# Altium project CRIB.PrjPcb (part 2 of 2)

## Sheet Throttle ADC.SchDoc
size A4; Organization: TESLA Motors, INC; Address1: 3500 Deer Creek Road; Address2: Palo Alto, CA; Address4: U.S.A.; SheetNumber: 10; SheetTotal: 17
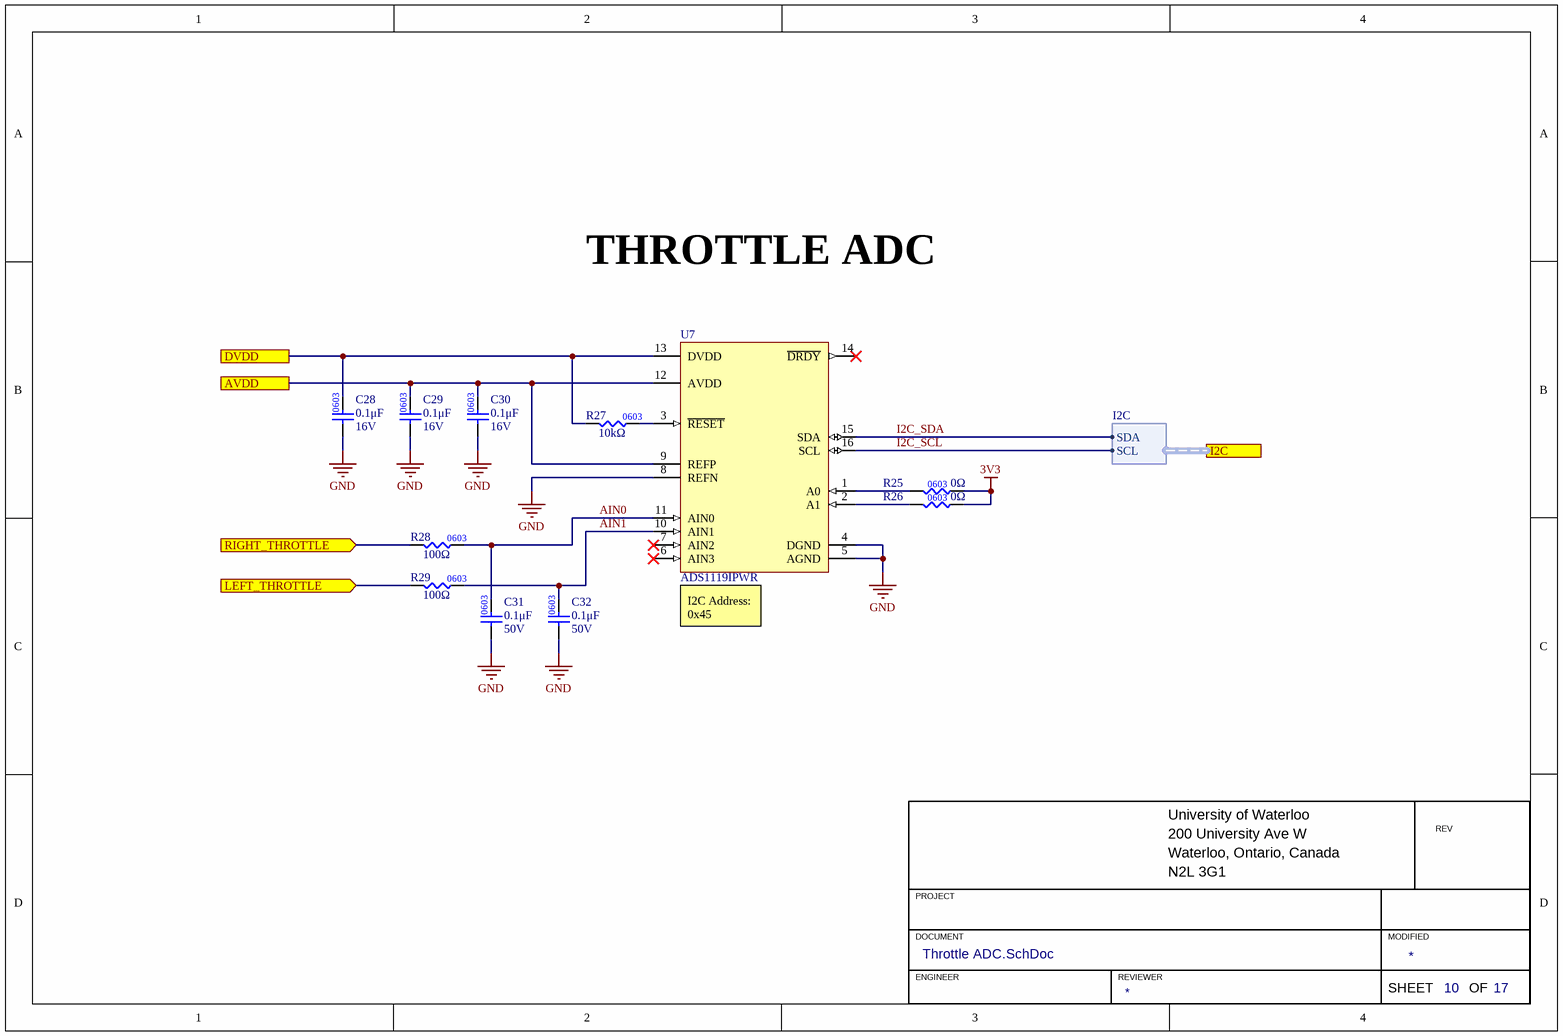
[diagram p10: Throttle ADC.SchDoc]

### Parts
C28  value 0.1μF  Voltage Rating: 16V  [CAP0603]  (hidden comment: CAP_0.1uF_16V_0603)
C29  value 0.1μF  Voltage Rating: 16V  [CAP0603]  (hidden comment: CAP_0.1uF_16V_0603)
C30  value 0.1μF  Voltage Rating: 16V  [CAP0603]  (hidden comment: CAP_0.1uF_16V_0603)
C31  value 0.1μF  Voltage Rating: 50V  [CAP0603]  (hidden comment: CAP_0.1uF_50V_0603)
C32  value 0.1μF  Voltage Rating: 50V  [CAP0603]  (hidden comment: CAP_0.1uF_50V_0603)
R25  value 0Ω  [RES0603]  (hidden comment: RES_0Ω_0603)
R26  value 0Ω  [RES0603]  (hidden comment: RES_0Ω_0603)
R27  value 10kΩ  [RES0603]  (hidden comment: RES_10kΩ_0603_1%)
R28  value 100Ω  [RES0603]  (hidden comment: RES_100Ω_0603_1%)
R29  value 100Ω  [RES0603]  (hidden comment: RES_100Ω_0603_1%)
U7  ADS1119IPWR  [TI_16-TSSOP]

### Ports
AVDD (see Top[3A]), DVDD (see Top[3A]), I2C (harness I2C, see Top[3A], Real Time Clock[4B], STM32 MCU[1A]), LEFT_THROTTLE (in, see Top[4A], Throttle Interfaces[2C]), RIGHT_THROTTLE (in, see Top[4A], Throttle Interfaces[2B])

### Harnesses
I2C: SDA, SCL

### Nets
3V3: C28.2 R25.1 R26.1 R27.1 U7.13(DVDD) ; port DVDD
5V0L: C29.2 C30.2 U7.9(REFP) U7.12(AVDD) ; port AVDD
GND: C28.1 C29.1 C30.1 C31.1 C32.1 U7.4(DGND) U7.5(AGND) U7.8(REFN)
AIN0: C31.2 R28.2 U7.11(AIN0)
AIN1: C32.2 R29.2 U7.10(AIN1)
I2C_SCL: U7.16(SCL) ; port I2C.SCL  [project net I2C.SCL]
I2C_SDA: U7.15(SDA) ; port I2C.SDA  [project net I2C.SDA]
LEFT_THROTTLE: R29.1 ; port LEFT_THROTTLE
RIGHT_THROTTLE: R28.1 ; port RIGHT_THROTTLE
NetR25_2: R25.2 U7.1(A0)
NetR26_2: R26.2 U7.2(A1)
NetR27_2: R27.2 U7.3(~{RESET})

Not connected (* = marked no-connect by the designer): U7 6(AIN3)* 7(AIN2)* 14(~{DRDY})*

### Notes on the sheet
- THROTTLE ADC
- (near U7) I2C Address:
  0x45
- University of Waterloo
- 200 University Ave W
- REV
- PROJECT
- Waterloo, Ontario, Canada
- N2L 3G1
- DOCUMENT
- ENGINEER
- REVIEWER
- MODIFIED
- SHEET
- OF
- (in symbol RES_100Ω_0603_1%) 0603

### Library data of the parts
C28-C30 = CAP_0.1uF_16V_0603: CAP CER 0.1UF 16V X7R 0603; Manufacturer Part Number 1: CC0603KRX7R7BB104; Manufacturer 1: Yageo; Package: 0603; Supplier Part Number 1: 311-1088-1-ND; Supplier 1: Digi-Key; Dielectric: X7R
C31 C32 = CAP_0.1uF_50V_0603: as C8 on sheet System Voltage Regulators; Supplier Part Number 1: 311-1344-1-ND; Supplier 1: Digi-Key; Mounting Type: SMD; Dielectric: X7R
R25 R26 = RES_0Ω_0603: RES 0 OHM JUMPER 1/10W 0603; Manufacturer 1: Yageo; Manufacturer Part Number 1: RC0603JR-070RL; Supplier Part Number 1: 311-0.0GRCT-ND; Supplier 1: Digi-Key; Mounting Type: SMD; Package: 0603
R27 = RES_10kΩ_0603_1%: as R33 on sheet STM32 MCU; Supplier Part Number 1: RNCP0603FTD10K0CT-ND; Supplier 1: Digi-Key; Mounting Type: SMD; Package: 0603
R28 R29 = RES_100Ω_0603_1%: RES 100 OHM 1% 1/10W 0603; Manufacturer 1: Yageo; Manufacturer Part Number 1: RC0603FR-07100RL; Supplier Part Number 1: 311-100HRCT-ND; Supplier 1: Digi-Key
U7 = ADS1119IPWR: IC ADC 16BIT SIGMA-DELTA 16TSSOP; Manufacturer 1: Texas Instruments; Manufacturer Part Number 1: ADS1119IPWR; Footprint: 16-TSSOP; Supplier 1: Digikey; Supplier Part Number 1: 296-50874-1-ND

## Sheet Throttle Interfaces.SchDoc
size A4; Organization: TESLA Motors, INC; Address1: 3500 Deer Creek Road; Address2: Palo Alto, CA; Address4: U.S.A.; SheetNumber: 12; SheetTotal: 21
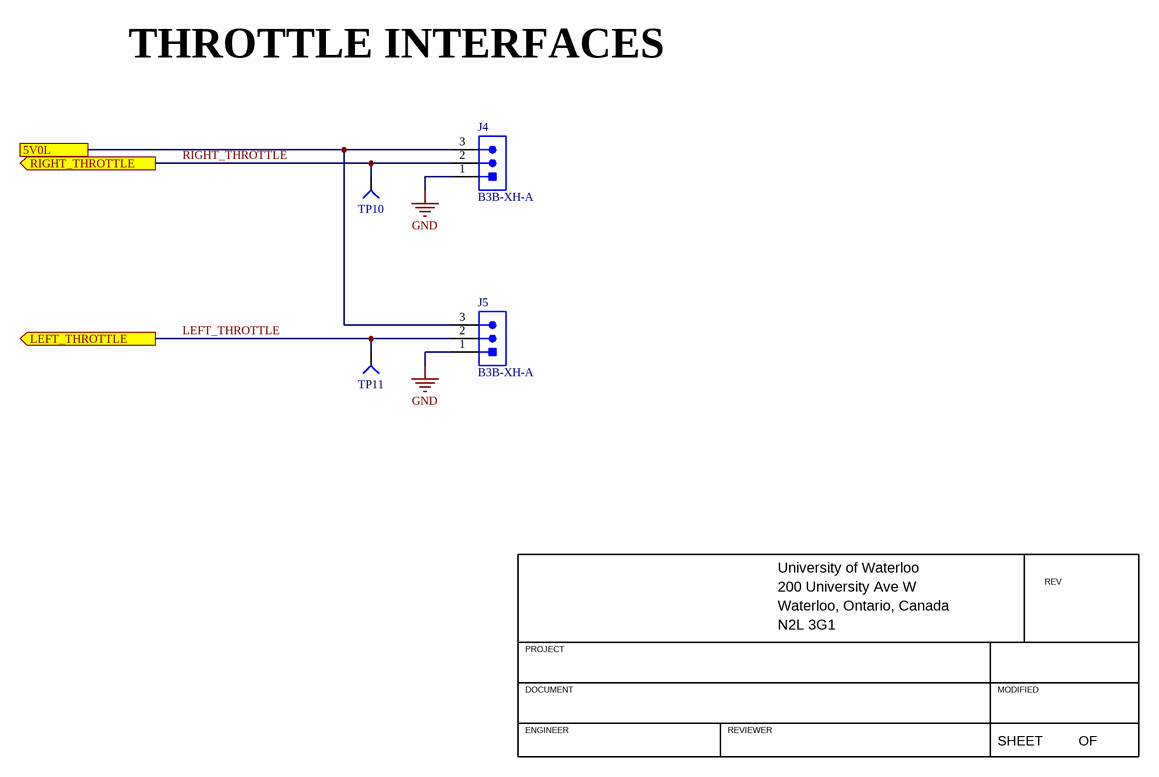
[diagram p11: Throttle Interfaces.SchDoc]

### Parts
J4  Manufacturer Part Number 1: B3B-XH-A  [JST_XH_3POS]  (hidden comment: CON_JST_3POS)
J5  Manufacturer Part Number 1: B3B-XH-A  [JST_XH_3POS]  (hidden comment: CON_JST_3POS)
TP10  TESTPOINT_1MM_CIRCLE  [TESTPOINT_CIRCLE_1MM]  (value not drawn)  (no BOM)
TP11  TESTPOINT_1MM_CIRCLE  [TESTPOINT_CIRCLE_1MM]  (value not drawn)  (no BOM)

### Ports
5V0L, LEFT_THROTTLE (out), RIGHT_THROTTLE (out)

### Nets
5V0L: J4.3 J5.3 ; port 5V0L
GND: J4.1 J5.1
LEFT_THROTTLE: J5.2 TP11.1(=value) ; port LEFT_THROTTLE
RIGHT_THROTTLE: J4.2 TP10.1(=value) ; port RIGHT_THROTTLE

### Notes on the sheet
- THROTTLE INTERFACES
- University of Waterloo
- 200 University Ave W
- REV
- PROJECT
- Waterloo, Ontario, Canada
- N2L 3G1
- DOCUMENT
- ENGINEER
- REVIEWER
- MODIFIED
- SHEET
- OF

### Library data of the parts
J4 J5 = CON_JST_3POS: CONN HEADER VERT 3POS 2.5MM; Manufacturer 1: JST Sales America Inc.; Voltage Rating: 250VAC; Current Rating: 3A; Pitch: 2.5mm; Supplier 1: Digi-Key; Supplier Part Number 1: 455-2248-ND
TP10 TP11 = TESTPOINT_1MM_CIRCLE: TESTPOINT 1MM CIRCLE

## Sheet Real Time Clock.SchDoc
size A4; Organization: TESLA Motors, INC; Address1: 3500 Deer Creek Road; Address2: Palo Alto, CA; Address4: U.S.A.; SheetNumber: 13; SheetTotal: 21
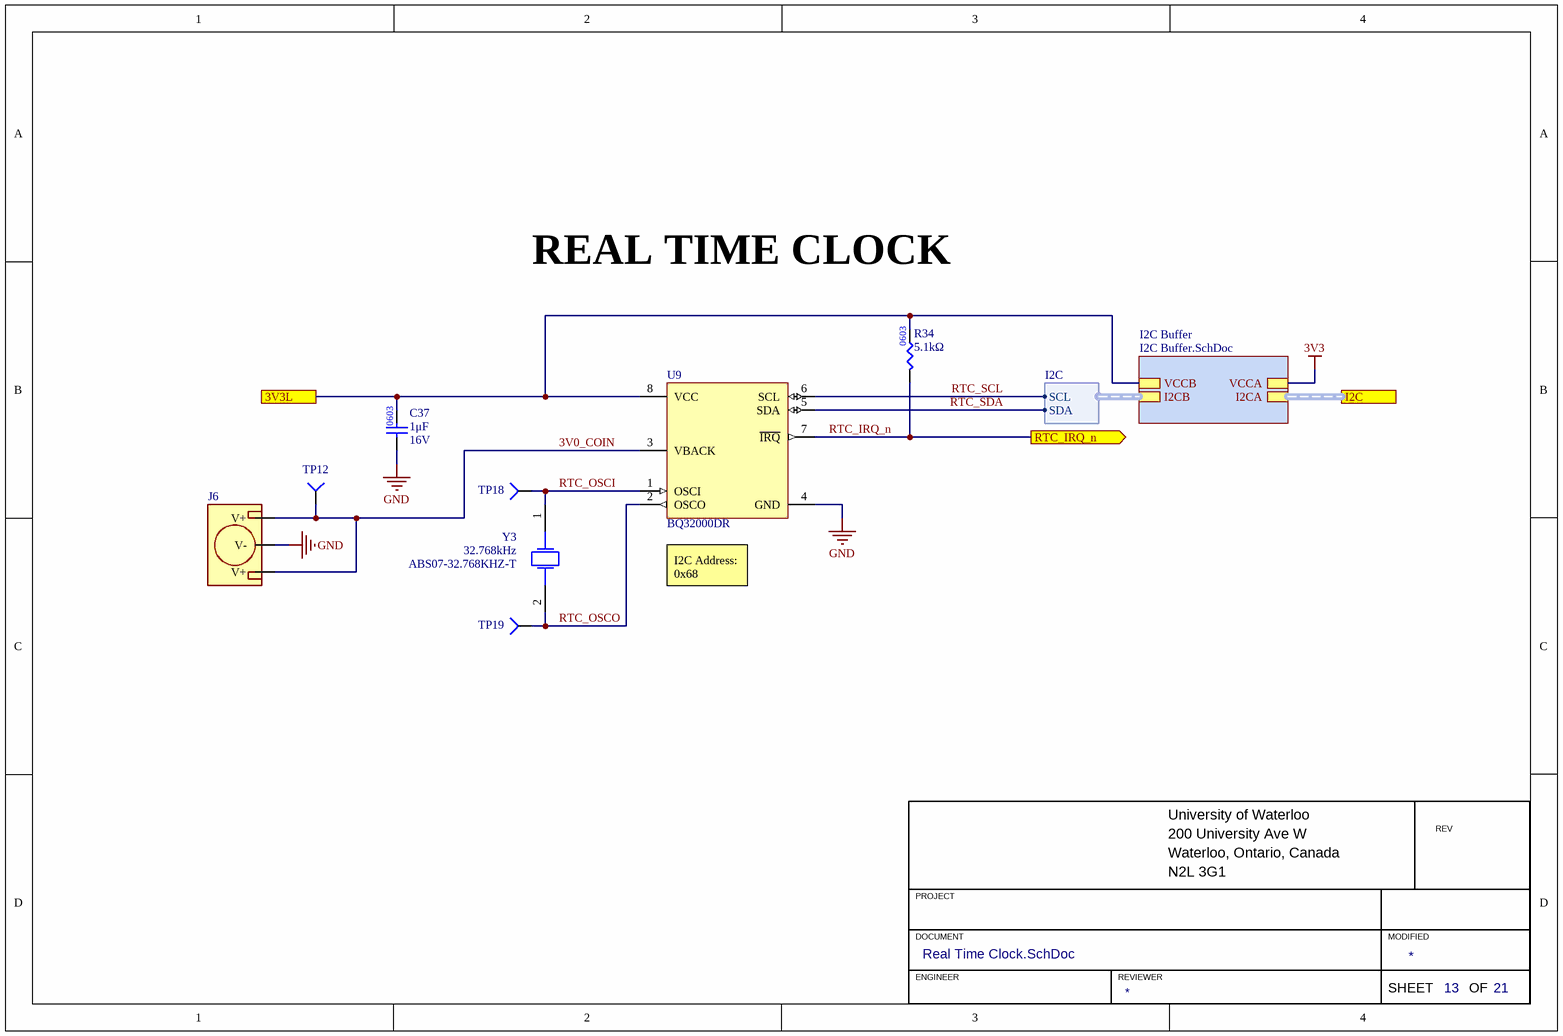
[diagram p12: Real Time Clock.SchDoc]

### Parts
C37  value 1μF  Voltage Rating: 16V  [CAP0603]  (hidden comment: CAP_1uF_16V_0603)
J6  CON_2POS_CR1220  [ATECH_COIN_12MM]  (value not drawn)
R34  value 5.1kΩ  [RES0603]  (hidden comment: RES_5.1kΩ_0603_1%)
TP12  TESTPOINT_1MM_CIRCLE  [TESTPOINT_CIRCLE_1MM]  (value not drawn)  (no BOM)
TP18  TESTPOINT_1MM_CIRCLE  [TESTPOINT_CIRCLE_1MM]  (value not drawn)  (no BOM)
TP19  TESTPOINT_1MM_CIRCLE  [TESTPOINT_CIRCLE_1MM]  (value not drawn)  (no BOM)
U9  BQ32000DR  [TI_8-SOIC]
Y3  Frequency: 32.768kHz  Manufacturer Part Number 1: ABS07-32.768KHZ-T  [OSC_ABS07]  (hidden comment: CRYSTAL_32.768KHZ_ABRACON)

### Sub-sheets
I2C Buffer = I2C Buffer.SchDoc: I2CA (harness I2C), I2CB (harness I2C), VCCA, VCCB

### Ports
3V3L, I2C (harness I2C), RTC_IRQ_n (out)

### Harnesses
I2C: SDA, SCL

### Nets
3V3L: C37.2 R34.2 U9.8(VCC) ; port 3V3L, sheet I2C Buffer/VCCB
GND: C37.1 J6.2(V-) U9.4(GND)
3V0_COIN: J6.1(V+) TP12.1(=value) U9.3(VBACK)
RTC_IRQ_n: R34.1 U9.7(~{IRQ}) ; port RTC_IRQ_n
RTC_OSCI: TP18.1(=value) U9.1(OSCI) Y3.1
RTC_OSCO: TP19.1(=value) U9.2(OSCO) Y3.2
RTC_SCL: U9.6(SCL) ; sheet I2C Buffer/I2CB.SCL
RTC_SDA: U9.5(SDA) ; sheet I2C Buffer/I2CB.SDA

### Buses and harness runs
harness port I2C = sheet I2C Buffer/I2CA

### Notes on the sheet
- REAL TIME CLOCK
- (near U9) I2C Address:
  0x68
- University of Waterloo
- 200 University Ave W
- REV
- PROJECT
- Waterloo, Ontario, Canada
- N2L 3G1
- DOCUMENT
- ENGINEER
- REVIEWER
- MODIFIED
- SHEET
- OF

### Library data of the parts
C37 = CAP_1uF_16V_0603: CAP CER 1UF 16V X7R 0603; Manufacturer 1: Yageo; Manufacturer Part Number 1: CC0603KPX7R7BB105; Supplier Part Number 1: 13-CC0603KPX7R7BB105CT-ND; Supplier 1: Digi-Key; Mounting Type: SMD; Package: 0603; Dielectric: X7R
J6 = CON_2POS_CR1220: BATTERY RETAINER COIN 12MM SMD; Manufacturer 1: Adam Tech; Manufacturer Part Number 1: BH-122A-5; Mounting Type: SMD; Supplier 1: Digi-Key; Supplier Part Number 1: 2057-BH-122A-5-ND
R34 = RES_5.1kΩ_0603_1%: RES 5.1K OHM 1% 1/10W 0603; Manufacturer 1: YAGEO; Manufacturer Part Number 1: RC0603FR-135K1L; Mounting Type: SMD; Package: 0603; Supplier 1: Digi-Key; Supplier Part Number 1: 13-RC0603FR-135K1LCT-ND
TP12 TP18 TP19 = TESTPOINT_1MM_CIRCLE: TESTPOINT 1MM CIRCLE
U9 = BQ32000DR: IC RTC CLK/CALENDAR I2C 8SOIC; Manufacturer 1: Texas Instruments; Package/Footprint: 8-SOIC; Supplier 1: Digi-Key; Supplier Part Number 1: 296-24583-1-ND; Manufacturer Part Number 1: BQ32000DR
Y3 = CRYSTAL_32.768KHZ_ABRACON: CRYSTAL 32.7680KHZ 12.5PF SMD; Manufacturer 1: Abracon LLC; Supplier 1: Digi-Key; Supplier Part Number 1: 535-9542-1-ND

## Sheet I2C Buffer.SchDoc
size A4; Organization: TESLA Motors, INC; Address1: 3500 Deer Creek Road; Address2: Palo Alto, CA; Address4: U.S.A.; SheetNumber: 13; SheetTotal: 17
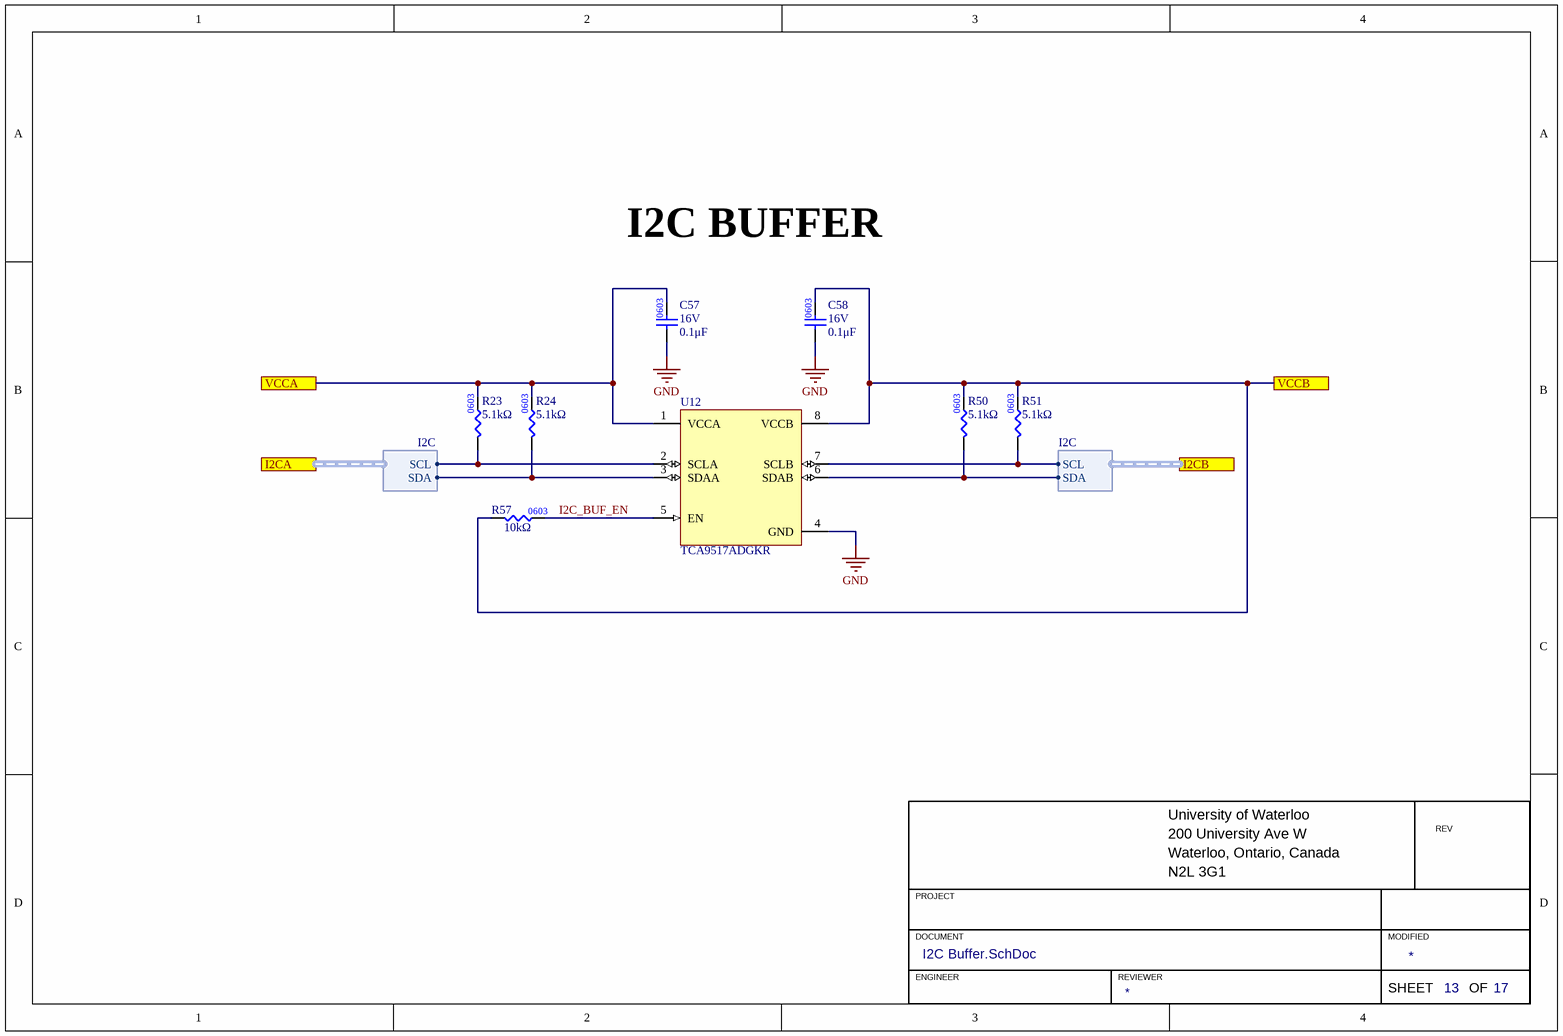
[diagram p13: I2C Buffer.SchDoc]

### Parts
C57  value 0.1μF  Voltage Rating: 16V  [CAP0603]  (hidden comment: CAP_0.1uF_16V_0603)
C58  value 0.1μF  Voltage Rating: 16V  [CAP0603]  (hidden comment: CAP_0.1uF_16V_0603)
R23  value 5.1kΩ  [RES0603]  (hidden comment: RES_5.1kΩ_0603_1%)
R24  value 5.1kΩ  [RES0603]  (hidden comment: RES_5.1kΩ_0603_1%)
R50  value 5.1kΩ  [RES0603]  (hidden comment: RES_5.1kΩ_0603_1%)
R51  value 5.1kΩ  [RES0603]  (hidden comment: RES_5.1kΩ_0603_1%)
R57  value 10kΩ  [RES0603]  (hidden comment: RES_10kΩ_0603_1%)
U12  TCA9517ADGKR  [TI_8-VSSOP]

### Ports
I2CA (harness I2C, see Real Time Clock[4B]), I2CB (harness I2C, see Real Time Clock[3B]), VCCA (see Real Time Clock[4B]), VCCB (see Real Time Clock[3B])

### Harnesses
I2C: SDA, SCL

### Nets
3V3: C57.2 R23.2 R24.2 U12.1(VCCA) ; port VCCA
3V3L: C58.2 R50.2 R51.2 R57.1 U12.8(VCCB) ; port VCCB
GND: C57.1 C58.1 U12.4(GND)
I2C.SCL: R23.1 U12.2(SCLA) ; port I2CA.SCL
I2C.SDA: R24.1 U12.3(SDAA) ; port I2CA.SDA
I2C_BUF_EN: R57.2 U12.5(EN)
RTC_SCL: R51.1 U12.7(SCLB) ; port I2CB.SCL
RTC_SDA: R50.1 U12.6(SDAB) ; port I2CB.SDA

### Notes on the sheet
- I2C BUFFER
- University of Waterloo
- 200 University Ave W
- REV
- PROJECT
- Waterloo, Ontario, Canada
- N2L 3G1
- DOCUMENT
- ENGINEER
- REVIEWER
- MODIFIED
- SHEET
- OF

### Library data of the parts
C57 C58 = CAP_0.1uF_16V_0603: as C28 on sheet Throttle ADC; Package: 0603; Supplier Part Number 1: 311-1088-1-ND; Supplier 1: Digi-Key; Dielectric: X7R
R23 R24 R50 R51 = RES_5.1kΩ_0603_1%: as R34 on sheet Real Time Clock; Mounting Type: SMD; Package: 0603; Supplier 1: Digi-Key; Supplier Part Number 1: 13-RC0603FR-135K1LCT-ND
R57 = RES_10kΩ_0603_1%: as R33 on sheet STM32 MCU; Supplier Part Number 1: RNCP0603FTD10K0CT-ND; Supplier 1: Digi-Key; Mounting Type: SMD; Package: 0603
U12 = TCA9517ADGKR: IC XLTR VL BIDIR 8-VSSOP; Manufacturer 1: Texas Instruments; Package/Footprint: 8-TSSOP; Manufacturer Part Number 1: TCA9517ADGKR; Supplier 1: Digikey; Supplier Part Number 1: 296-39220-1-ND

## Sheet SD Card Interface.SchDoc
size A4; Organization: TESLA Motors, INC; Address1: 3500 Deer Creek Road; Address2: Palo Alto, CA; Address4: U.S.A.; SheetNumber: 15; SheetTotal: 21
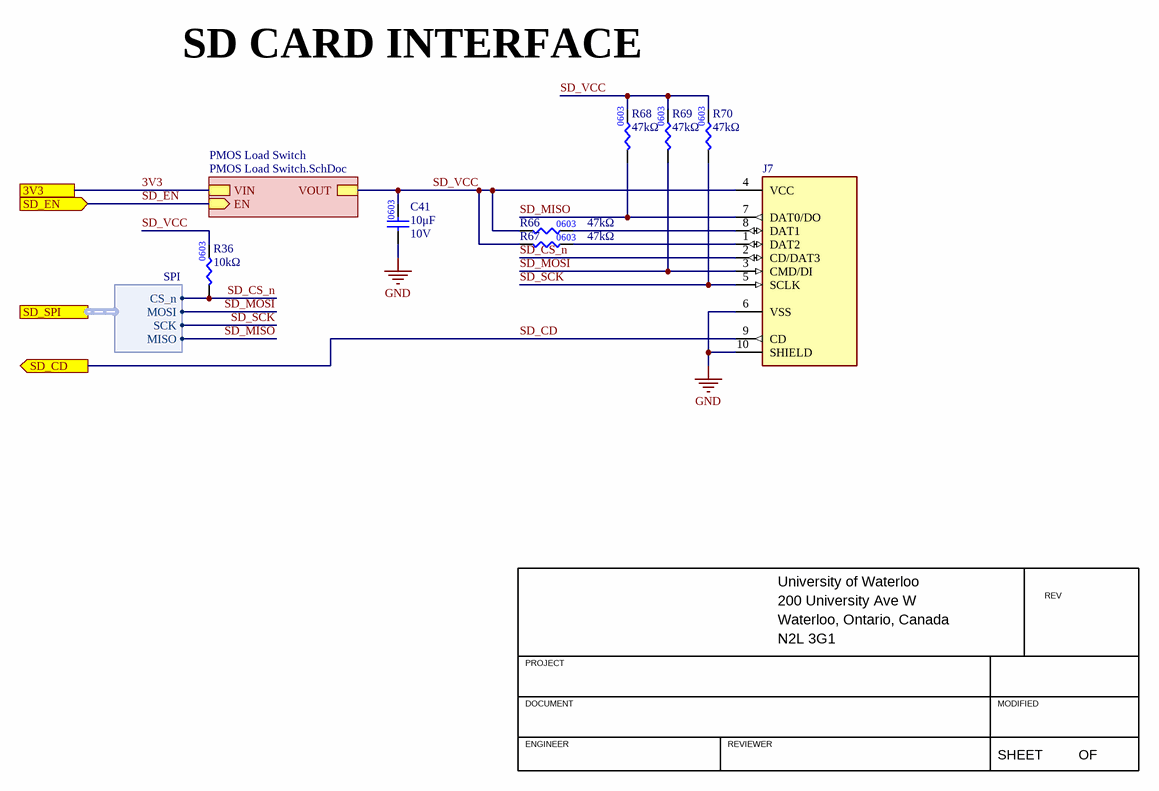
[diagram p14: SD Card Interface.SchDoc]

### Parts
C41  value 10μF  Voltage Rating: 10V  [CAP0603]  (hidden comment: CAP_10uF_10V_0603)
J7  CON_MICROSD_MOLEX  [MOLEX-5033981892]  (value not drawn)
R36  value 10kΩ  [RES0603]  (hidden comment: RES_10kΩ_0603_1%)
R66  value 47kΩ  [RES0603]  (hidden comment: RES_47kΩ_0603_1%)
R67  value 47kΩ  [RES0603]  (hidden comment: RES_47kΩ_0603_1%)
R68  value 47kΩ  [RES0603]  (hidden comment: RES_47kΩ_0603_1%)
R69  value 47kΩ  [RES0603]  (hidden comment: RES_47kΩ_0603_1%)
R70  value 47kΩ  [RES0603]  (hidden comment: RES_47kΩ_0603_1%)

### Sub-sheets
PMOS Load Switch = PMOS Load Switch.SchDoc: VIN, VOUT, EN (in)

### Ports
3V3, SD_CD (out), SD_EN (in), SD_SPI (harness SPI)

### Harnesses
SPI: CS_n, MOSI, MISO, SCK

### Nets
3V3: port 3V3, sheet PMOS Load Switch/VIN
GND: C41.1 J7.6(VSS) J7.10(SHIELD)
SD_CD: J7.9(CD) ; port SD_CD
SD_CS_n: J7.2(CD/DAT3) R36.1 ; port SD_SPI.CS_n
SD_EN: port SD_EN, sheet PMOS Load Switch/EN
SD_MISO: J7.7(DAT0/DO) R68.1 ; port SD_SPI.MISO
SD_MOSI: J7.3(CMD/DI) R69.1 ; port SD_SPI.MOSI
SD_SCK: J7.5(SCLK) R70.1 ; port SD_SPI.SCK
SD_VCC: C41.2 J7.4(VCC) R36.2 R66.1 R67.1 R68.2 R69.2 R70.2 ; sheet PMOS Load Switch/VOUT
NetJ7_1: J7.1(DAT2) R67.2
NetJ7_8: J7.8(DAT1) R66.2

### Notes on the sheet
- SD CARD INTERFACE
- University of Waterloo
- 200 University Ave W
- REV
- PROJECT
- Waterloo, Ontario, Canada
- N2L 3G1
- DOCUMENT
- ENGINEER
- REVIEWER
- MODIFIED
- SHEET
- OF
- (in symbol CAP_10uF_10V_0603) 0603

### Library data of the parts
C41 = CAP_10uF_10V_0603: CAP CER 10UF 10V X5R 0603; Manufacturer Part Number 1: CC0603MRX5R6BB106; Manufacturer 1: Yageo; Supplier Part Number 1: 311-1817-1-ND; Supplier 1: Digi-Key; Dielectric: X5R
J7 = CON_MICROSD_MOLEX: CONN MICRO SD CARD R/A SMD; Manufacturer 1: Molex; Manufacturer Part Number 1: 5033981892; Supplier 1: Digi-Key; Package/Footprint: SMD; Supplier Part Number 1: WM11190CT-ND
R36 = RES_10kΩ_0603_1%: as R33 on sheet STM32 MCU; Supplier Part Number 1: RNCP0603FTD10K0CT-ND; Supplier 1: Digi-Key; Mounting Type: SMD; Package: 0603
R66-R70 = RES_47kΩ_0603_1%: RES 47K OHM 1% 1/10W 0603; Manufacturer 1: YAGEO; Manufacturer Part Number 1: RC0603FR-0747KL; Mounting Type: SMD; Package: 0603; Supplier 1: DigiKey; Supplier Part Number 1: 311-4.70KHRCT-ND

## Sheet PMOS Load Switch.SchDoc
size A4; Organization: TESLA Motors, INC; Address1: 3500 Deer Creek Road; Address2: Palo Alto, CA; Address4: U.S.A.; SheetNumber: 16; SheetTotal: 21
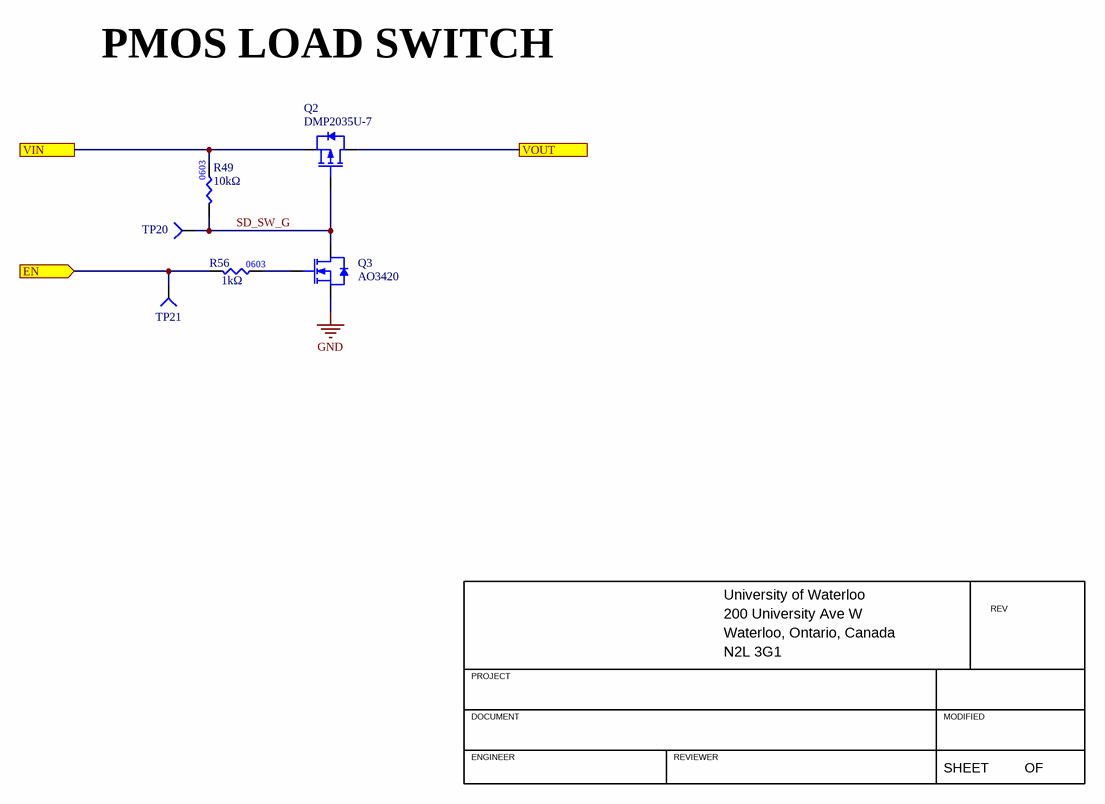
[diagram p15: PMOS Load Switch.SchDoc]

### Parts
Q2  Manufacturer Part Number 1: DMP2035U-7  [DIO-INC_SOT23]  (hidden comment: PMOS_20V_3.6A)
Q3  Manufacturer Part Number 1: AO3420  [SOT23-3]  (hidden comment: NMOS_20V_6A)
R49  value 10kΩ  [RES0603]  (hidden comment: RES_10kΩ_0603_1%)
R56  value 1kΩ  [RES0603]  (hidden comment: RES_1kΩ_0603_1%)
TP20  TESTPOINT_1MM_CIRCLE  [TESTPOINT_CIRCLE_1MM]  (value not drawn)  (no BOM)
TP21  TESTPOINT_1MM_CIRCLE  [TESTPOINT_CIRCLE_1MM]  (value not drawn)  (no BOM)

### Ports
EN (in, see SD Card Interface[2B]), VIN (see SD Card Interface[2B]), VOUT (see SD Card Interface[3B])

### Nets
3V3: Q2.2(Source) R49.2 ; port VIN
GND: Q3.2(SOURCE)
SD_EN: R56.1 TP21.1(=value) ; port EN
SD_SW_G: Q2.1(Gate) Q3.3(DRAIN) R49.1 TP20.1(=value)
SD_VCC: Q2.3(Drain) ; port VOUT
NetQ3_1: Q3.1(GATE) R56.2

### Notes on the sheet
- PMOS LOAD SWITCH
- University of Waterloo
- 200 University Ave W
- REV
- PROJECT
- Waterloo, Ontario, Canada
- N2L 3G1
- DOCUMENT
- ENGINEER
- REVIEWER
- MODIFIED
- SHEET
- OF

### Library data of the parts
Q2 = PMOS_20V_3.6A: MOSFET P-CH 20V 3.6A SOT23-3; Manufacturer 1: Diodes Incorporated; Supplier 1: Digi-Key; Supplier Part Number 1: DMP2035U-7DICT-ND
Q3 = NMOS_20V_6A: MOSFET N-CH 20V 6A SOT-23; Manufacturer 1: Alpha & Omega; Supplier 1: Digi-Key; Supplier Part Number 1: 785-1014-2-ND
R49 = RES_10kΩ_0603_1%: RES 10K OHM 1% 1/8W 0603; Manufacturer 1: Stackpole Electronics Inc; Manufacturer Part Number 1: RNCP0603FTD10K0; Supplier Part Number 1: RNCP0603FTD10K0CT-ND; Supplier 1: Digi-Key; Mounting Type: SMD; Package: 0603
R56 = RES_1kΩ_0603_1%: RES 1K OHM 1% 1/8W 0603; Manufacturer 1: Stackpole Electronics Inc; Manufacturer Part Number 1: RNCP0603FTD1K00; Supplier Part Number 1: RNCP0603FTD1K00CT-ND; Supplier 1: Digi-Key; Mounting Type: SMD; Package: 0603
TP20 TP21 = TESTPOINT_1MM_CIRCLE: TESTPOINT 1MM CIRCLE

## Sheet LED Lamp Interfaces.SchDoc
size A4; Organization: TESLA Motors, INC; Address1: 3500 Deer Creek Road; Address2: Palo Alto, CA; Address4: U.S.A.; SheetNumber: 17; SheetTotal: 21
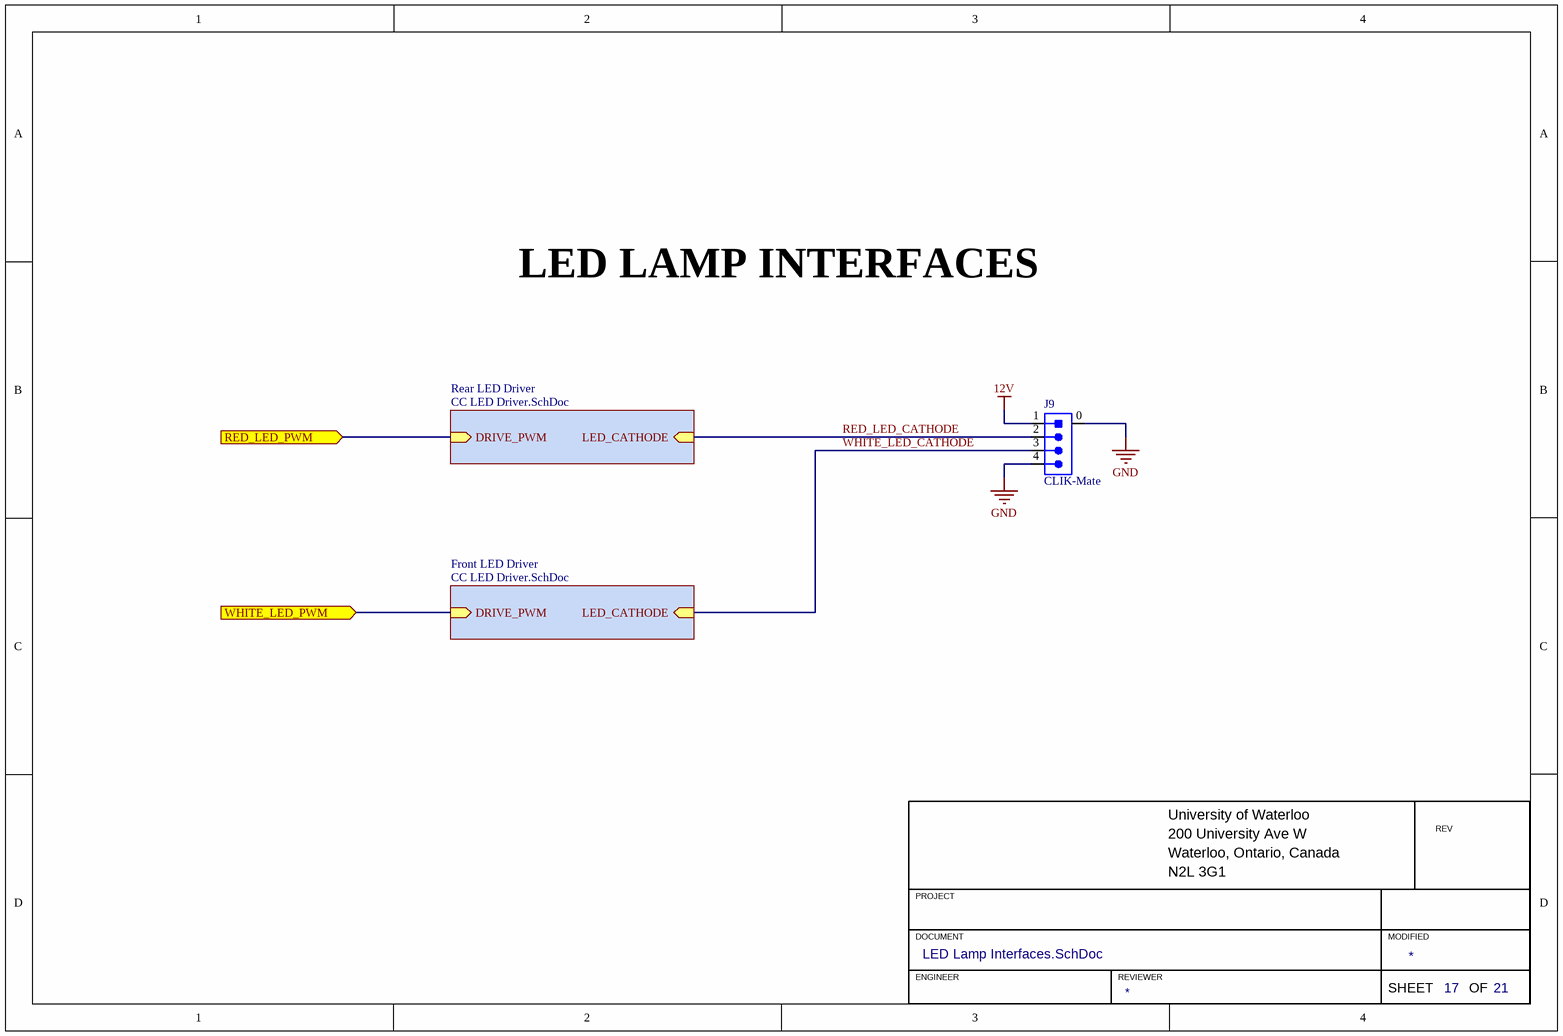
[diagram p16: LED Lamp Interfaces.SchDoc]

### Parts
J9  Family: CLIK-Mate  [MOLEX-5025850470]  (hidden comment: CON_4M_SM_RA)

### Sub-sheets
Front LED Driver = CC LED Driver.SchDoc: LED_CATHODE (in), DRIVE_PWM (in)
Rear LED Driver = CC LED Driver.SchDoc: LED_CATHODE (in), DRIVE_PWM (in)

### Ports
RED_LED_PWM (in), WHITE_LED_PWM (in)

### Nets
12V: J9.1
GND: J9.0 J9.4
RED_LED_CATHODE: J9.2 ; sheet Rear LED Driver/LED_CATHODE
RED_LED_PWM: port RED_LED_PWM, sheet Rear LED Driver/DRIVE_PWM
WHITE_LED_CATHODE: J9.3 ; sheet Front LED Driver/LED_CATHODE
WHITE_LED_PWM: port WHITE_LED_PWM, sheet Front LED Driver/DRIVE_PWM

### Notes on the sheet
- LED LAMP INTERFACES
- University of Waterloo
- 200 University Ave W
- REV
- PROJECT
- Waterloo, Ontario, Canada
- N2L 3G1
- DOCUMENT
- ENGINEER
- REVIEWER
- MODIFIED
- SHEET
- OF

### Library data of the parts
J9 = CON_4M_SM_RA: CONN HEADER SMD RIGHT ANGLE 1.5 MM PITCH; Supplier 1: Digi-Key; Supplier Part Number 1: WM9449CT-ND; Package/Footprint: SMD; Mounting Type: SMD

## Sheet CC LED Driver.SchDoc
size A4; Organization: TESLA Motors, INC; Address1: 3500 Deer Creek Road; Address2: Palo Alto, CA; Address4: U.S.A.; SheetNumber: 18; SheetTotal: 21
Used 2 times, as channels LED Lamp Interfaces/Rear LED Driver, LED Lamp Interfaces/Front LED Driver. Parts and nets are listed once, with the designators drawn on the sheet.
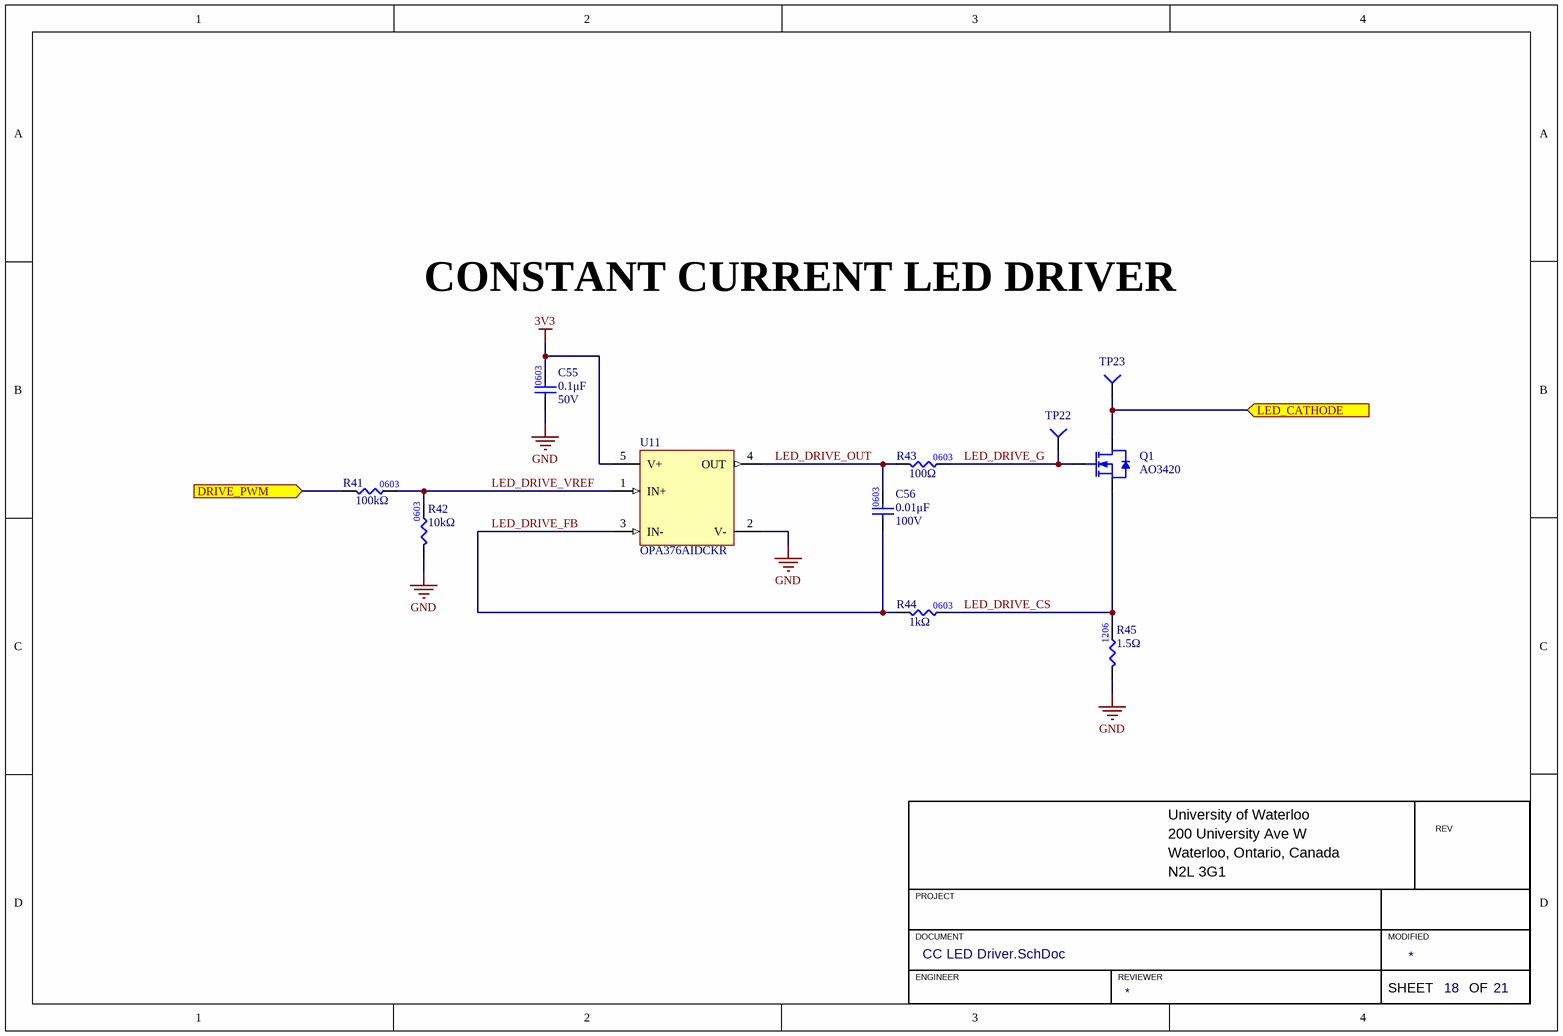
[diagram p17: CC LED Driver.SchDoc]

### Parts
C55  value 0.1μF  Voltage Rating: 50V  [CAP0603]  (hidden comment: CAP_0.1uF_50V_0603)
C56  value 0.01μF  Voltage Rating: 100V  [CAP0603]  (hidden comment: CAP_0.01uF_100V_0603)
Q1  Manufacturer Part Number 1: AO3420  [SOT23-3]  (hidden comment: NMOS_20V_6A)
R41  value 100kΩ  [RES0603]  (hidden comment: RES_100kΩ_0603_1%)
R42  value 10kΩ  [RES0603]  (hidden comment: RES_10kΩ_0603_1%)
R43  value 100Ω  [RES0603]  (hidden comment: RES_100Ω_0603_1%)
R44  value 1kΩ  [RES0603]  (hidden comment: RES_1kΩ_0603_1%)
R45  value 1.5Ω  [RES1206]  (hidden comment: RES_1.5Ω_1206_1%)
TP22  TESTPOINT_1MM_CIRCLE  [TESTPOINT_CIRCLE_1MM]  (value not drawn)  (no BOM)
TP23  TESTPOINT_1MM_CIRCLE  [TESTPOINT_CIRCLE_1MM]  (value not drawn)  (no BOM)
U11  OPA376AIDCKR  [TI_SC-70-5]

### Ports
DRIVE_PWM (in), LED_CATHODE (in)

### Nets
3V3: C55.2 U11.5(V+)
GND: C55.1 R42.1 R45.1 U11.2(V-)
DRIVE_PWM: R41.1 ; port DRIVE_PWM
LED_CATHODE: Q1.3(DRAIN) TP23.1(=value) ; port LED_CATHODE
LED_DRIVE_CS: Q1.2(SOURCE) R44.2 R45.2
LED_DRIVE_FB: C56.1 R44.1 U11.3(IN-)
LED_DRIVE_G: Q1.1(GATE) R43.2 TP22.1(=value)
LED_DRIVE_OUT: C56.2 R43.1 U11.4(OUT)
LED_DRIVE_VREF: R41.2 R42.2 U11.1(IN+)

### Channels
LED Lamp Interfaces/Rear LED Driver: designators end in A; ports DRIVE_PWM=RED_LED_PWM LED_CATHODE=RED_LED_CATHODE
LED Lamp Interfaces/Front LED Driver: designators end in B; ports DRIVE_PWM=WHITE_LED_PWM LED_CATHODE=WHITE_LED_CATHODE

### Notes on the sheet
- CONSTANT CURRENT LED DRIVER
- University of Waterloo
- 200 University Ave W
- REV
- PROJECT
- Waterloo, Ontario, Canada
- N2L 3G1
- DOCUMENT
- ENGINEER
- REVIEWER
- MODIFIED
- SHEET
- OF
- (in symbol CAP_0.01uF_100V_0603) 0603
- (in symbol RES_100kΩ_0603_1%) 0603
- (in symbol RES_100Ω_0603_1%) 0603

### Library data of the parts
C55 = CAP_0.1uF_50V_0603: CAP CER 0.1UF 50V X7R 0603; Manufacturer Part Number 1: CC0603KRX7R9BB104; Manufacturer 1: Yageo; Package/Footprint: 0603; Supplier Part Number 1: 311-1344-1-ND; Supplier 1: Digi-Key; Mounting Type: SMD; Dielectric: X7R
C56 = CAP_0.01uF_100V_0603: CAP CER 0.01uF 100V X7R 0603; Manufacturer Part Number 1: GCM188R72A103KA37J; Manufacturer 1: Murata Electronics; Supplier Part Number 1: 490-8028-1-ND; Supplier 1: Digi-Key; Dielectric: X7R
Q1 = NMOS_20V_6A: as Q3 on sheet PMOS Load Switch; Supplier 1: Digi-Key; Supplier Part Number 1: 785-1014-2-ND
R41 = RES_100kΩ_0603_1%: RES 100K OHM 1% 1/10W 0603; Manufacturer 1: Yageo; Manufacturer Part Number 1: RC0603FR-07100KL; Supplier Part Number 1: 311-100KHRCT-ND; Supplier 1: Digi-Key
R42 = RES_10kΩ_0603_1%: as R49 on sheet PMOS Load Switch; Supplier Part Number 1: RNCP0603FTD10K0CT-ND; Supplier 1: Digi-Key; Mounting Type: SMD; Package: 0603
R43 = RES_100Ω_0603_1%: RES 100 OHM 1% 1/10W 0603; Manufacturer 1: Yageo; Manufacturer Part Number 1: RC0603FR-07100RL; Supplier Part Number 1: 311-100HRCT-ND; Supplier 1: Digi-Key
R44 = RES_1kΩ_0603_1%: as R56 on sheet PMOS Load Switch; Supplier Part Number 1: RNCP0603FTD1K00CT-ND; Supplier 1: Digi-Key; Mounting Type: SMD; Package: 0603
R45 = RES_1.5Ω_1206_1%: RES 1.5 OHM 1% 1/4W 1206; Manufacturer Part Number 1: RMCF1206FT1R50; Manufacturer 1: Stackpole Electronics Inc; Supplier 1: Digi-Key; Supplier Part Number 1: RMCF1206FT1R50CT-ND; Mounting Type: SMD; Power: 1/4W; Package: 1206; Tolerance: 1%
TP22 TP23 = TESTPOINT_1MM_CIRCLE: TESTPOINT 1MM CIRCLE
U11 = OPA376AIDCKR: IC OPAMP GP 1 CIRCUIT SC70-5; Manufacturer 1: Texas Instruments; Package/Footprint: 5-TSSOP; Operating Temperature: -40°C - 125°C; Supplier 1: Digi-Key; Supplier Part Number 1: 296-35916-1-ND; Manufacturer Part Number 1: OPA376AIDCKR

## Sheet User Interfaces.SchDoc
size A4; Organization: TESLA Motors, INC; Address1: 3500 Deer Creek Road; Address2: Palo Alto, CA; Address4: U.S.A.; SheetNumber: 19; SheetTotal: 21
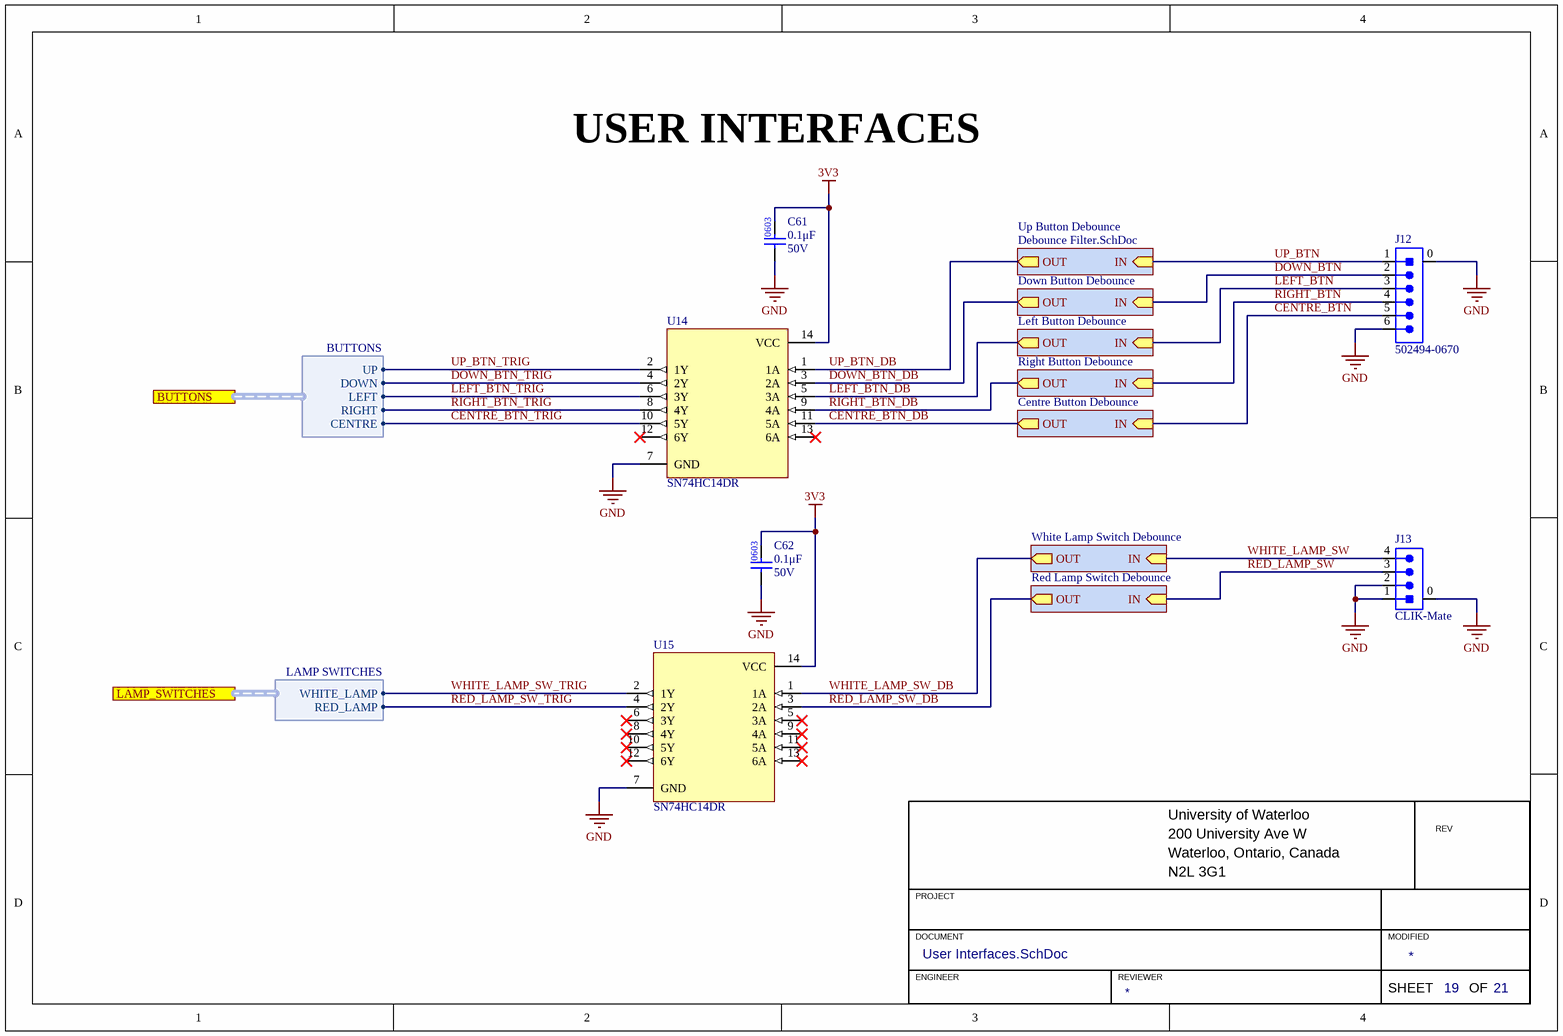
[diagram p18: User Interfaces.SchDoc]

### Parts
C61  value 0.1μF  Voltage Rating: 50V  [CAP0603]  (hidden comment: CAP_0.1uF_50V_0603)
C62  value 0.1μF  Voltage Rating: 50V  [CAP0603]  (hidden comment: CAP_0.1uF_50V_0603)
J12  Manufacturer Part Number 1: 502494-0670  [MOLEX-5024940670]  (hidden comment: CON_6M_SM_RA)
J13  Family: CLIK-Mate  [MOLEX-5025850470]  (hidden comment: CON_4M_SM_RA)
U14  SN74HC14DR  [TI_14-SOIC]
U15  SN74HC14DR  [TI_14-SOIC]

### Sub-sheets
Centre Button Debounce = Debounce Filter.SchDoc: IN (in), OUT (out)
Down Button Debounce = Debounce Filter.SchDoc: IN (in), OUT (out)
Left Button Debounce = Debounce Filter.SchDoc: IN (in), OUT (out)
Red Lamp Switch Debounce = Debounce Filter.SchDoc: IN (in), OUT (out)
Right Button Debounce = Debounce Filter.SchDoc: IN (in), OUT (out)
Up Button Debounce = Debounce Filter.SchDoc: IN (in), OUT (out)
White Lamp Switch Debounce = Debounce Filter.SchDoc: IN (in), OUT (out)

### Ports
BUTTONS (harness BUTTONS), LAMP_SWITCHES (harness LAMP SWITCHES)

### Harnesses
BUTTONS: UP, DOWN, LEFT, RIGHT, CENTRE
LAMP SWITCHES: WHITE_LAMP, RED_LAMP

### Nets
3V3: C61.2 C62.2 U14.14(VCC) U15.14(VCC)
GND: C61.1 C62.1 J12.0 J12.6 J13.0 J13.1 J13.2 U14.7(GND) U15.7(GND)
CENTRE_BTN: J12.5 ; sheet Centre Button Debounce/IN
CENTRE_BTN_DB: U14.11(5A) ; sheet Centre Button Debounce/OUT
CENTRE_BTN_TRIG: U14.10(5Y) ; port BUTTONS.CENTRE
DOWN_BTN: J12.2 ; sheet Down Button Debounce/IN
DOWN_BTN_DB: U14.3(2A) ; sheet Down Button Debounce/OUT
DOWN_BTN_TRIG: U14.4(2Y) ; port BUTTONS.DOWN
LEFT_BTN: J12.3 ; sheet Left Button Debounce/IN
LEFT_BTN_DB: U14.5(3A) ; sheet Left Button Debounce/OUT
LEFT_BTN_TRIG: U14.6(3Y) ; port BUTTONS.LEFT
RED_LAMP_SW: J13.3 ; sheet Red Lamp Switch Debounce/IN
RED_LAMP_SW_DB: U15.3(2A) ; sheet Red Lamp Switch Debounce/OUT
RED_LAMP_SW_TRIG: U15.4(2Y) ; port LAMP_SWITCHES.RED_LAMP
RIGHT_BTN: J12.4 ; sheet Right Button Debounce/IN
RIGHT_BTN_DB: U14.9(4A) ; sheet Right Button Debounce/OUT
RIGHT_BTN_TRIG: U14.8(4Y) ; port BUTTONS.RIGHT
UP_BTN: J12.1 ; sheet Up Button Debounce/IN
UP_BTN_DB: U14.1(1A) ; sheet Up Button Debounce/OUT
UP_BTN_TRIG: U14.2(1Y) ; port BUTTONS.UP
WHITE_LAMP_SW: J13.4 ; sheet White Lamp Switch Debounce/IN
WHITE_LAMP_SW_DB: U15.1(1A) ; sheet White Lamp Switch Debounce/OUT
WHITE_LAMP_SW_TRIG: U15.2(1Y) ; port LAMP_SWITCHES.WHITE_LAMP

Not connected (* = marked no-connect by the designer): U14 12(6Y)* 13(6A)*; U15 5(3A)* 6(3Y)* 8(4Y)* 9(4A)* 10(5Y)* 11(5A)* 12(6Y)* 13(6A)*

### Notes on the sheet
- USER INTERFACES
- University of Waterloo
- 200 University Ave W
- REV
- PROJECT
- Waterloo, Ontario, Canada
- N2L 3G1
- DOCUMENT
- ENGINEER
- REVIEWER
- MODIFIED
- SHEET
- OF

### Library data of the parts
C61 C62 = CAP_0.1uF_50V_0603: CAP CER 0.1UF 50V X7R 0603; Manufacturer 1: Yageo; Manufacturer Part Number 1: CC0603KRX7R9BB104; Package/Footprint: 0603; Supplier 1: Digi-Key; Supplier Part Number 1: 311-1344-1-ND; Mounting Type: SMD; Dielectric: X7R
J12 = CON_6M_SM_RA: CONN HEADER SMD RIGHT ANGLE 2MM PITCH; Manufacturer 1: Molex; Current Rating: 3A; Voltage Rating: 250V; Supplier 1: Digi-Key; Orientation: Right Angle; Pitch: 2mm; Supplier Part Number 1: WM2283CT-ND
J13 = CON_4M_SM_RA: CONN HEADER SMD RIGHT ANGLE 1.5 MM PITCH; Supplier 1: Digi-Key; Supplier Part Number 1: WM9449CT-ND; Package/Footprint: SMD; Mounting Type: SMD
U14 U15 = SN74HC14DR: IC INVERT SCHMITT 6CH 1IN 14SOIC; Manufacturer 1: Texas Instruments; Package/Footprint: 14-SOIC; Manufacturer Part Number 1: SN74HC14DR; Supplier 1: Digikey; Supplier Part Number 1: 296-1194-1-ND

## Sheet Debounce Filter.SchDoc
size A4; Organization: TESLA Motors, INC; Address1: 3500 Deer Creek Road; Address2: Palo Alto, CA; Address4: U.S.A.; SheetNumber: 20; SheetTotal: 21
Used 7 times, as channels User Interfaces/Up Button Debounce, User Interfaces/Down Button Debounce, User Interfaces/Left Button Debounce, User Interfaces/Right Button Debounce, User Interfaces/Centre Button Debounce, User Interfaces/White Lamp Switch Debounce, User Interfaces/Red Lamp Switch Debounce. Parts and nets are listed once, with the designators drawn on the sheet.
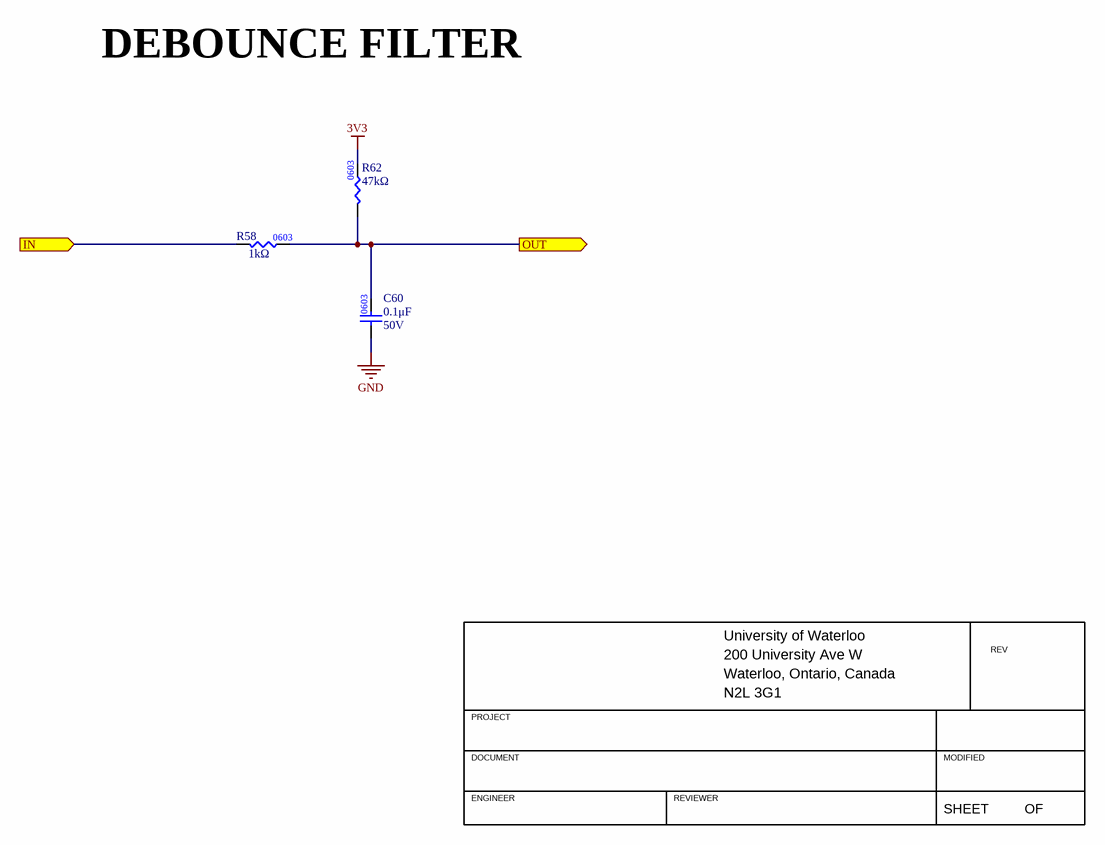
[diagram p19: Debounce Filter.SchDoc]

### Parts
C60  value 0.1μF  Voltage Rating: 50V  [CAP0603]  (hidden comment: CAP_0.1uF_50V_0603)
R58  value 1kΩ  [RES0603]  (hidden comment: RES_1kΩ_0603_1%)
R62  value 47kΩ  [RES0603]  (hidden comment: RES_47kΩ_0603_1%)

### Ports
IN (in), OUT (out)

### Nets
3V3: R62.2
GND: C60.1
IN: R58.1 ; port IN
OUT: C60.2 R58.2 R62.1 ; port OUT

### Channels
User Interfaces/Up Button Debounce: designators end in A; ports IN=UP_BTN OUT=UP_BTN_DB
User Interfaces/Down Button Debounce: designators end in B; ports IN=DOWN_BTN OUT=DOWN_BTN_DB
User Interfaces/Left Button Debounce: designators end in C; ports IN=LEFT_BTN OUT=LEFT_BTN_DB
User Interfaces/Right Button Debounce: designators end in D; ports IN=RIGHT_BTN OUT=RIGHT_BTN_DB
User Interfaces/Centre Button Debounce: designators end in E; ports IN=CENTRE_BTN OUT=CENTRE_BTN_DB
User Interfaces/White Lamp Switch Debounce: designators end in F; ports IN=WHITE_LAMP_SW OUT=WHITE_LAMP_SW_DB
User Interfaces/Red Lamp Switch Debounce: designators end in G; ports IN=RED_LAMP_SW OUT=RED_LAMP_SW_DB

### Notes on the sheet
- DEBOUNCE FILTER
- University of Waterloo
- 200 University Ave W
- REV
- PROJECT
- Waterloo, Ontario, Canada
- N2L 3G1
- DOCUMENT
- ENGINEER
- REVIEWER
- MODIFIED
- SHEET
- OF

### Library data of the parts
C60 = CAP_0.1uF_50V_0603: as C61 on sheet User Interfaces; Supplier 1: Digi-Key; Supplier Part Number 1: 311-1344-1-ND; Mounting Type: SMD; Dielectric: X7R
R58 = RES_1kΩ_0603_1%: as R56 on sheet PMOS Load Switch; Supplier Part Number 1: RNCP0603FTD1K00CT-ND; Supplier 1: Digi-Key; Mounting Type: SMD; Package: 0603
R62 = RES_47kΩ_0603_1%: RES 47K OHM 1% 1/10W 0603; Manufacturer 1: YAGEO; Manufacturer Part Number 1: RC0603FR-0747KL; Supplier Part Number 1: 311-4.70KHRCT-ND; Supplier 1: DigiKey; Mounting Type: SMD; Package: 0603

## Sheet Debug Interface.SchDoc
size A4; Organization: TESLA Motors, INC; Address1: 3500 Deer Creek Road; Address2: Palo Alto, CA; Address4: U.S.A.; SheetNumber: 21; SheetTotal: 21
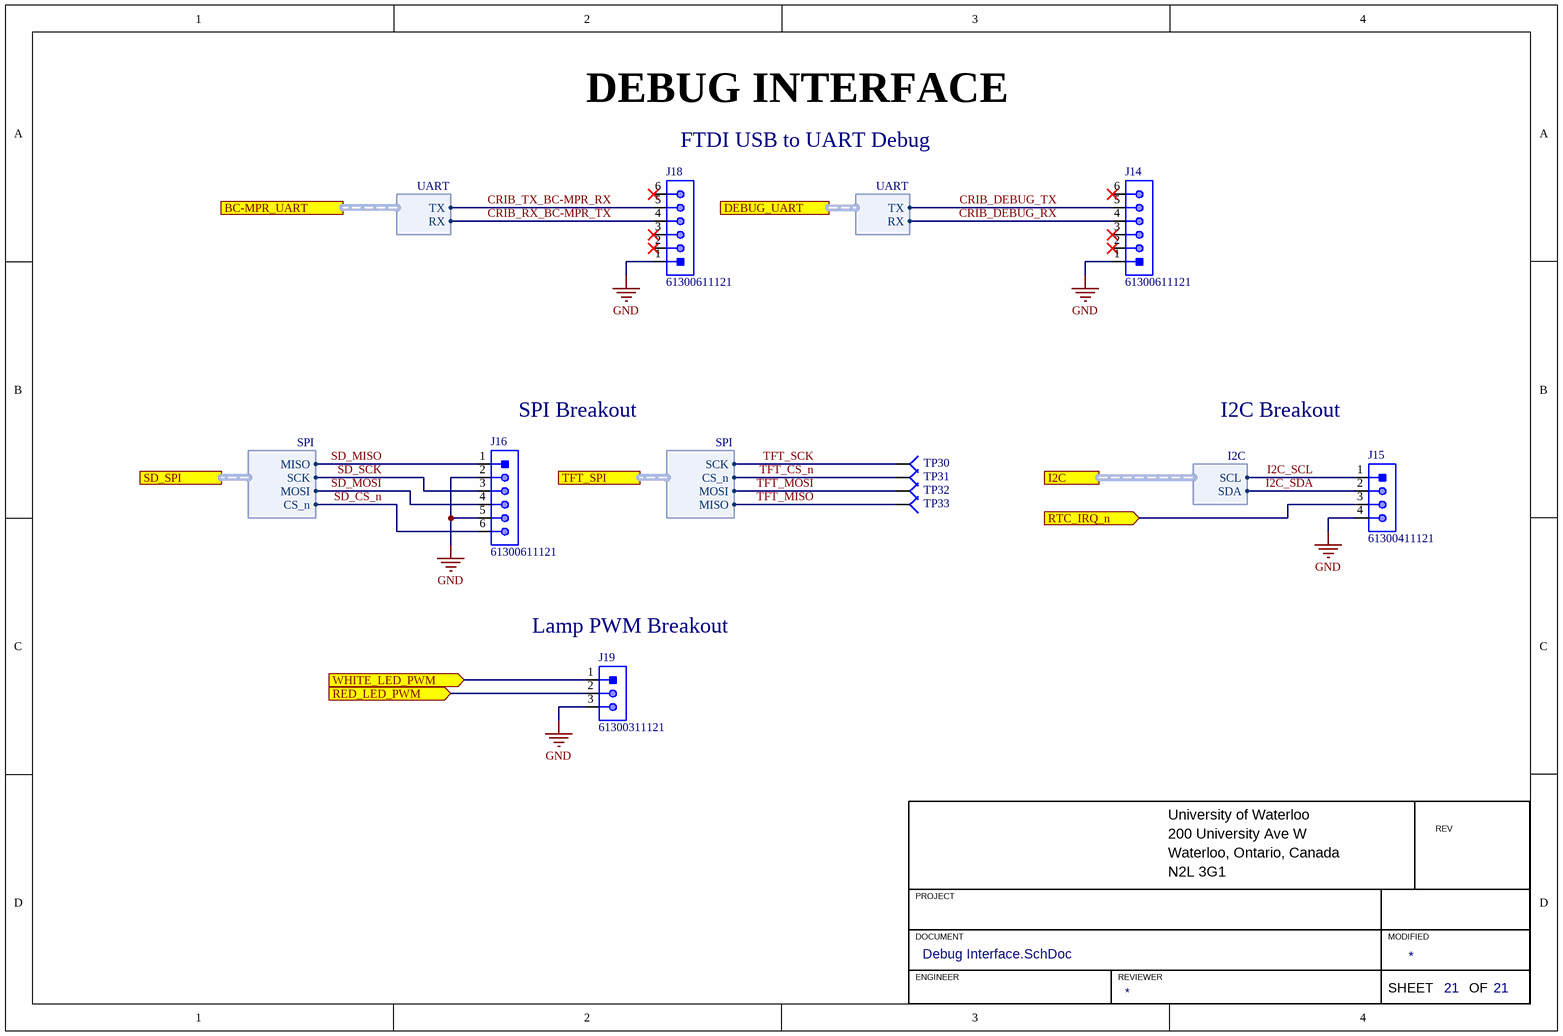
[diagram p20: Debug Interface.SchDoc]

### Parts
J14  Manufacturer Part Number 1: 61300611121  [HDR1X6]  (hidden comment: HEADER 6x1)
J15  Manufacturer Part Number 1: 61300411121  [HDR1X4]  (hidden comment: HEADER 4x1)
J16  Manufacturer Part Number 1: 61300611121  [HDR1X6]  (hidden comment: HEADER 6x1)
J18  Manufacturer Part Number 1: 61300611121  [HDR1X6]  (hidden comment: HEADER 6x1)
J19  Manufacturer Part Number 1: 61300311121  [HDR1X3]  (hidden comment: HEADER 3x1)
TP30  TESTPOINT_1MM_CIRCLE  [TESTPOINT_CIRCLE_1MM]  (value not drawn)  (no BOM)
TP31  TESTPOINT_1MM_CIRCLE  [TESTPOINT_CIRCLE_1MM]  (value not drawn)  (no BOM)
TP32  TESTPOINT_1MM_CIRCLE  [TESTPOINT_CIRCLE_1MM]  (value not drawn)  (no BOM)
TP33  TESTPOINT_1MM_CIRCLE  [TESTPOINT_CIRCLE_1MM]  (value not drawn)  (no BOM)

### Ports
BC-MPR_UART (harness UART), DEBUG_UART (harness UART), I2C (harness I2C), RED_LED_PWM (in), RTC_IRQ_n (in), SD_SPI (harness SPI), TFT_SPI (harness SPI), WHITE_LED_PWM (in)

### Harnesses
UART: TX, RX
I2C: SCL, SDA
SPI: CS_n, MOSI, MISO, SCK

### Nets
GND: J14.1 J15.4 J16.2 J16.5 J18.1 J19.3
CRIB_DEBUG_RX: J14.4 ; port DEBUG_UART.RX
CRIB_DEBUG_TX: J14.5 ; port DEBUG_UART.TX
CRIB_RX_BC-MPR_TX: J18.4 ; port BC-MPR_UART.RX  [project net BC-MPR_UART.RX]
CRIB_TX_BC-MPR_RX: J18.5 ; port BC-MPR_UART.TX  [project net BC-MPR_UART.TX]
I2C_SCL: J15.1 ; port I2C.SCL  [project net I2C.SCL]
I2C_SDA: J15.2 ; port I2C.SDA  [project net I2C.SDA]
RED_LED_PWM: J19.2 ; port RED_LED_PWM
RTC_IRQ_n: J15.3 ; port RTC_IRQ_n
SD_CS_n: J16.6 ; port SD_SPI.CS_n
SD_MISO: J16.1 ; port SD_SPI.MISO
SD_MOSI: J16.4 ; port SD_SPI.MOSI
SD_SCK: J16.3 ; port SD_SPI.SCK
TFT_CS_n: TP31.1(=value) ; port TFT_SPI.CS_n
TFT_MISO: TP33.1(=value) ; port TFT_SPI.MISO
TFT_MOSI: TP32.1(=value) ; port TFT_SPI.MOSI
TFT_SCK: TP30.1(=value) ; port TFT_SPI.SCK
WHITE_LED_PWM: J19.1 ; port WHITE_LED_PWM

Not connected (* = marked no-connect by the designer): J14 2* 3* 6*; J18 2* 3* 6*

### Notes on the sheet
- DEBUG INTERFACE
- (near J18) FTDI USB to UART Debug
- (near J16) SPI Breakout
- I2C Breakout
- (near J19) Lamp PWM Breakout
- University of Waterloo
- 200 University Ave W
- REV
- PROJECT
- Waterloo, Ontario, Canada
- N2L 3G1
- DOCUMENT
- ENGINEER
- REVIEWER
- MODIFIED
- SHEET
- OF

### Library data of the parts
J14 J16 J18 = HEADER 6x1: CONN HEADER VERT 6POS 2.54MM; Manufacturer 1: Würth Elektronik; Supplier 1: Digi-Key; Mounting Type: TH; Pitch: 2.54mm; Supplier Part Number 1: 732-5319-ND
J15 = HEADER 4x1: CONN HEADER VERT 4POS 2.54MM; Manufacturer 1: Würth Elektronik; Mounting Type: TH; Pitch: 2.54mm; Supplier 1: Digikey; Supplier Part Number 1: 732-5317-ND
J19 = HEADER 3x1: CONN HEADER VERT 3POS 2.54MM; Manufacturer 1: Würth Elektronik; Supplier 1: Digi-Key; Mounting Type: TH; Pitch: 2.54mm; Supplier Part Number 1: 732-5316-ND
TP30-TP33 = TESTPOINT_1MM_CIRCLE: TESTPOINT 1MM CIRCLE

## Nets that join several sheets
3V3: STM32 MCU (R33.2), MCU Power Clock Debug (17 pins), Lithium Battery Charger (LED1.1 LED2.1), Auxiliary Regulators (5 pins), Throttle ADC (5 pins), I2C Buffer (C57.2 R23.2 R24.2 U12.1), PMOS Load Switch (Q2.2 R49.2), LED Lamp Interfaces/Rear LED Driver (C55A.2 U11A.5), LED Lamp Interfaces/Front LED Driver (C55B.2 U11B.5), User Interfaces (C61.2 C62.2 U14.14 U15.14), User Interfaces/Up Button Debounce (R62A.2), User Interfaces/Down Button Debounce (R62B.2), User Interfaces/Left Button Debounce (R62C.2), User Interfaces/Right Button Debounce (R62D.2), User Interfaces/Centre Button Debounce (R62E.2), User Interfaces/White Lamp Switch Debounce (R62F.2), User Interfaces/Red Lamp Switch Debounce (R62G.2)
3V3L: Auxiliary Regulators (5 pins), Real Time Clock (C37.2 R34.2 U9.8), I2C Buffer (5 pins)
5V0: System Voltage Regulators (7 pins), OR Power Switch (C20.2 U5.6)
5V0L: Auxiliary Regulators (5 pins), Throttle ADC (C29.2 C30.2 U7.9 U7.12), Throttle Interfaces (J4.3 J5.3)
5V4: System Voltage Regulators (8 pins), Lithium Battery Charger (C1.2 U2.1), OR Power Switch (C19.2 LED5.1 U5.8), Auxiliary Regulators (C38.2 C39.2 R35.1 U10.1)
5V_SYS: TFT Display Interface (J1.26 J1.27), OR Power Switch (5 pins), Auxiliary Regulators (9 pins)
12V: System Voltage Regulators (7 pins), BC-MPR Interface (J2.1), LED Lamp Interfaces (J9.1)
GND: Top (TP24.1 TP25.1 TP26.1 TP27.1), MCU Power Clock Debug (26 pins), TFT Display Interface (11 pins), System Voltage Regulators (23 pins), Lithium Battery UVP Switch (C63.1 R61.1 U13.2), Lithium Battery Charger (9 pins), BC-MPR Interface (J2.2 J3.1 J3.4 J3.6), OR Power Switch (9 pins), Auxiliary Regulators (19 pins), Throttle ADC (8 pins), Throttle Interfaces (J4.1 J5.1), Real Time Clock (C37.1 J6.2 U9.4), I2C Buffer (C57.1 C58.1 U12.4), SD Card Interface (C41.1 J7.6 J7.10), PMOS Load Switch (Q3.2), LED Lamp Interfaces (J9.0 J9.4), LED Lamp Interfaces/Rear LED Driver (C55A.1 R42A.1 R45A.1 U11A.2), LED Lamp Interfaces/Front LED Driver (C55B.1 R42B.1 R45B.1 U11B.2), User Interfaces (9 pins), User Interfaces/Up Button Debounce (C60A.1), User Interfaces/Down Button Debounce (C60B.1), User Interfaces/Left Button Debounce (C60C.1), User Interfaces/Right Button Debounce (C60D.1), User Interfaces/Centre Button Debounce (C60E.1), User Interfaces/White Lamp Switch Debounce (C60F.1), User Interfaces/Red Lamp Switch Debounce (C60G.1), Debug Interface (6 pins)
VBAT_3V6: Lithium Battery UVP Switch (C63.2 Q4.2 R60.2 U13.1), Lithium Battery Charger (C2.2 Q6.2 TP4.1 U2.8)
12V_DETECT: STM32 MCU (U1.14), System Voltage Regulators (C59.2 R39.1 R40.2)
BC-MPR_UART.RX: STM32 MCU (U1.17), BC-MPR Interface (R17.1), Debug Interface (J18.4)
BC-MPR_UART.TX: STM32 MCU (U1.16), BC-MPR Interface (R16.1), Debug Interface (J18.5)
CENTRE_BTN: User Interfaces (J12.5), User Interfaces/Centre Button Debounce (R58E.1)
CENTRE_BTN_DB: User Interfaces (U14.11), User Interfaces/Centre Button Debounce (C60E.2 R58E.2 R62E.1)
CENTRE_BTN_TRIG: STM32 MCU (U1.30), User Interfaces (U14.10)
CRIB_DEBUG_RX: STM32 MCU (U1.59), Debug Interface (J14.4)
CRIB_DEBUG_TX: STM32 MCU (U1.58), Debug Interface (J14.5)
DOWN_BTN: User Interfaces (J12.2), User Interfaces/Down Button Debounce (R58B.1)
DOWN_BTN_DB: User Interfaces (U14.3), User Interfaces/Down Button Debounce (C60B.2 R58B.2 R62B.1)
DOWN_BTN_TRIG: STM32 MCU (U1.27), User Interfaces (U14.4)
I2C.SCL: STM32 MCU (U1.61), Throttle ADC (U7.16), I2C Buffer (R23.1 U12.2), Debug Interface (J15.1)
I2C.SDA: STM32 MCU (U1.62), Throttle ADC (U7.15), I2C Buffer (R24.1 U12.3), Debug Interface (J15.2)
LEFT_BTN: User Interfaces (J12.3), User Interfaces/Left Button Debounce (R58C.1)
LEFT_BTN_DB: User Interfaces (U14.5), User Interfaces/Left Button Debounce (C60C.2 R58C.2 R62C.1)
LEFT_BTN_TRIG: STM32 MCU (U1.28), User Interfaces (U14.6)
LEFT_THROTTLE: Throttle ADC (R29.1), Throttle Interfaces (J5.2 TP11.1)
MCU_HB: STM32 MCU (U1.39), MCU Power Clock Debug (Q5.1 R55.2)
MOTOR_BRAKE: STM32 MCU (U1.21), BC-MPR Interface (J3.5)
MOTOR_DIR: STM32 MCU (U1.22), BC-MPR Interface (J3.7)
MOTOR_THROTTLE: STM32 MCU (U1.20), BC-MPR Interface (J3.8)
RED_LAMP_SW: User Interfaces (J13.3), User Interfaces/Red Lamp Switch Debounce (R58G.1)
RED_LAMP_SW_DB: User Interfaces (U15.3), User Interfaces/Red Lamp Switch Debounce (C60G.2 R58G.2 R62G.1)
RED_LAMP_SW_TRIG: STM32 MCU (U1.25), User Interfaces (U15.4)
RED_LED_CATHODE: LED Lamp Interfaces (J9.2), LED Lamp Interfaces/Rear LED Driver (Q1A.3 TP23A.1)
RED_LED_PWM: STM32 MCU (U1.42), LED Lamp Interfaces/Rear LED Driver (R41A.1), Debug Interface (J19.2)
RIGHT_BTN: User Interfaces (J12.4), User Interfaces/Right Button Debounce (R58D.1)
RIGHT_BTN_DB: User Interfaces (U14.9), User Interfaces/Right Button Debounce (C60D.2 R58D.2 R62D.1)
RIGHT_BTN_TRIG: STM32 MCU (U1.29), User Interfaces (U14.8)
RIGHT_THROTTLE: Throttle ADC (R28.1), Throttle Interfaces (J4.2 TP10.1)
RTC_IRQ_n: STM32 MCU (U1.51), Real Time Clock (R34.1 U9.7), Debug Interface (J15.3)
RTC_SCL: Real Time Clock (U9.6), I2C Buffer (R51.1 U12.7)
RTC_SDA: Real Time Clock (U9.5), I2C Buffer (R50.1 U12.6)
SD_CD: STM32 MCU (U1.37), SD Card Interface (J7.9)
SD_CS_n: STM32 MCU (U1.33), SD Card Interface (J7.2 R36.1), Debug Interface (J16.6)
SD_EN: STM32 MCU (U1.38), PMOS Load Switch (R56.1 TP21.1)
SD_MISO: STM32 MCU (U1.35), SD Card Interface (J7.7 R68.1), Debug Interface (J16.1)
SD_MOSI: STM32 MCU (U1.36), SD Card Interface (J7.3 R69.1), Debug Interface (J16.4)
SD_SCK: STM32 MCU (U1.34), SD Card Interface (J7.5 R70.1), Debug Interface (J16.3)
SD_VCC: SD Card Interface (8 pins), PMOS Load Switch (Q2.3)
SWCLK: STM32 MCU (U1.49), MCU Power Clock Debug (J11.2)
SWDIO: STM32 MCU (U1.46), MCU Power Clock Debug (J11.3)
TFT_CS_n: STM32 MCU (R33.1 U1.54), TFT Display Interface (J1.4), Debug Interface (TP31.1)
TFT_INT_n: STM32 MCU (U1.52), TFT Display Interface (J1.3)
TFT_MISO: STM32 MCU (U1.56), TFT Display Interface (J1.7), Debug Interface (TP33.1)
TFT_MOSI: STM32 MCU (U1.57), TFT Display Interface (J1.6), Debug Interface (TP32.1)
TFT_RST_n: STM32 MCU (U1.53), TFT Display Interface (J1.2)
TFT_SCK: STM32 MCU (U1.55), TFT Display Interface (J1.8), Debug Interface (TP30.1)
UP_BTN: User Interfaces (J12.1), User Interfaces/Up Button Debounce (R58A.1)
UP_BTN_DB: User Interfaces (U14.1), User Interfaces/Up Button Debounce (C60A.2 R58A.2 R62A.1)
UP_BTN_TRIG: STM32 MCU (U1.26), User Interfaces (U14.2)
VBAT_DSG: System Voltage Regulators (6 pins), Lithium Battery UVP Switch (Q4.3)
WHITE_LAMP_SW: User Interfaces (J13.4), User Interfaces/White Lamp Switch Debounce (R58F.1)
WHITE_LAMP_SW_DB: User Interfaces (U15.1), User Interfaces/White Lamp Switch Debounce (C60F.2 R58F.2 R62F.1)
WHITE_LAMP_SW_TRIG: STM32 MCU (U1.24), User Interfaces (U15.2)
WHITE_LED_CATHODE: LED Lamp Interfaces (J9.3), LED Lamp Interfaces/Front LED Driver (Q1B.3 TP23B.1)
WHITE_LED_PWM: STM32 MCU (U1.41), LED Lamp Interfaces/Front LED Driver (R41B.1), Debug Interface (J19.1)

## Assembly variants
BUILD: all parts fitted
JLC ASSY: not fitted J2 J3 J4 J5 J6 J7 J8 J9 J11 J12 J13 J14 J15 J16 J18 J19 L1 L2 L3 Y2